# EAGLE design PGA-103-Basic-preamp (EAGLE 7.7.0)
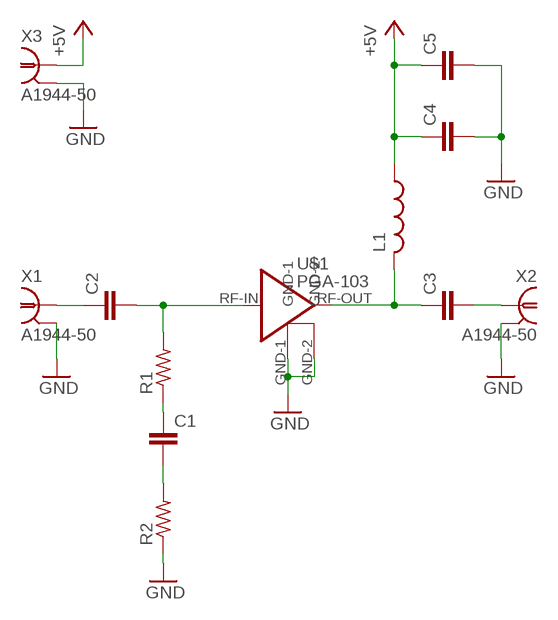
[diagram p0: schematic, sheet 1]

## Parts
C1  C-EUC1206  [C1206]
C2  C-EUC1206  [C1206]
C3  C-EUC1206  [C1206]
C4  C-EUC1206  [C1206]
C5  C-EUC1206  [C1206]
L1  L-US0204/7  [0204/7]
R1  R-US_M1206  [M1206]
R2  R-US_M1206  [M1206]
U$1  PGA-103  [DF782]
X1  A1944-50  [A1944]
X2  A1944-50  [A1944]
X3  A1944-50  [A1944]

## Nets
+5V: C4.1 C5.1 L1.1 X3.1
GND: C4.2 C5.2 R2.1 U$1.GND-1 U$1.GND-2 X1.2 X1.3 X1.4 X1.5 X2.2 X2.3 X2.4 X2.5 X3.2 X3.3 X3.4 X3.5
N$1: C2.1 X1.1
N$2: C3.1 L1.2 U$1.RF-OUT
N$3: C2.2 R1.2 U$1.RF-IN
N$4: C1.1 R1.1
N$5: C1.2 R2.2
N$6: C3.2 X2.1

## Library data of the parts
C1-C5 = rcl:C-EU: CAPACITOR, European symbol
L1 = rcl:L-US: INDUCTOR, American symbol
R1 R2 = rcl:R-US_: RESISTOR, American symbol
U$1 = minicircuits:PGA-103
X1-X3 = con-coax:A1944-50: BNC CONNECTOR 50 Ohm distributor Buerklin 78F2475; OC_FARNELL: unknown; OC_NEWARK: unknown

## Board
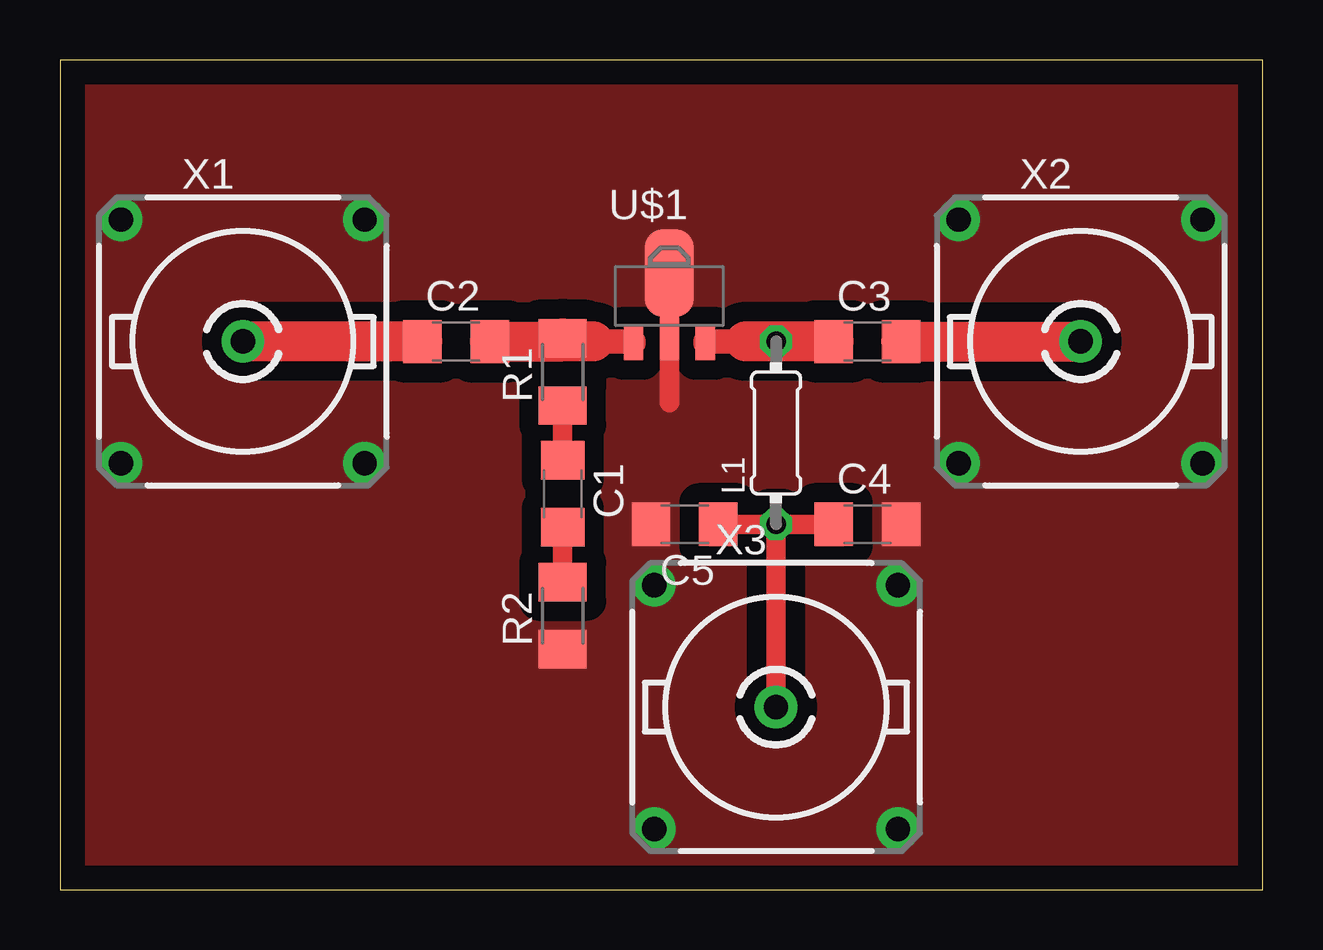
[diagram p1: board, top side]
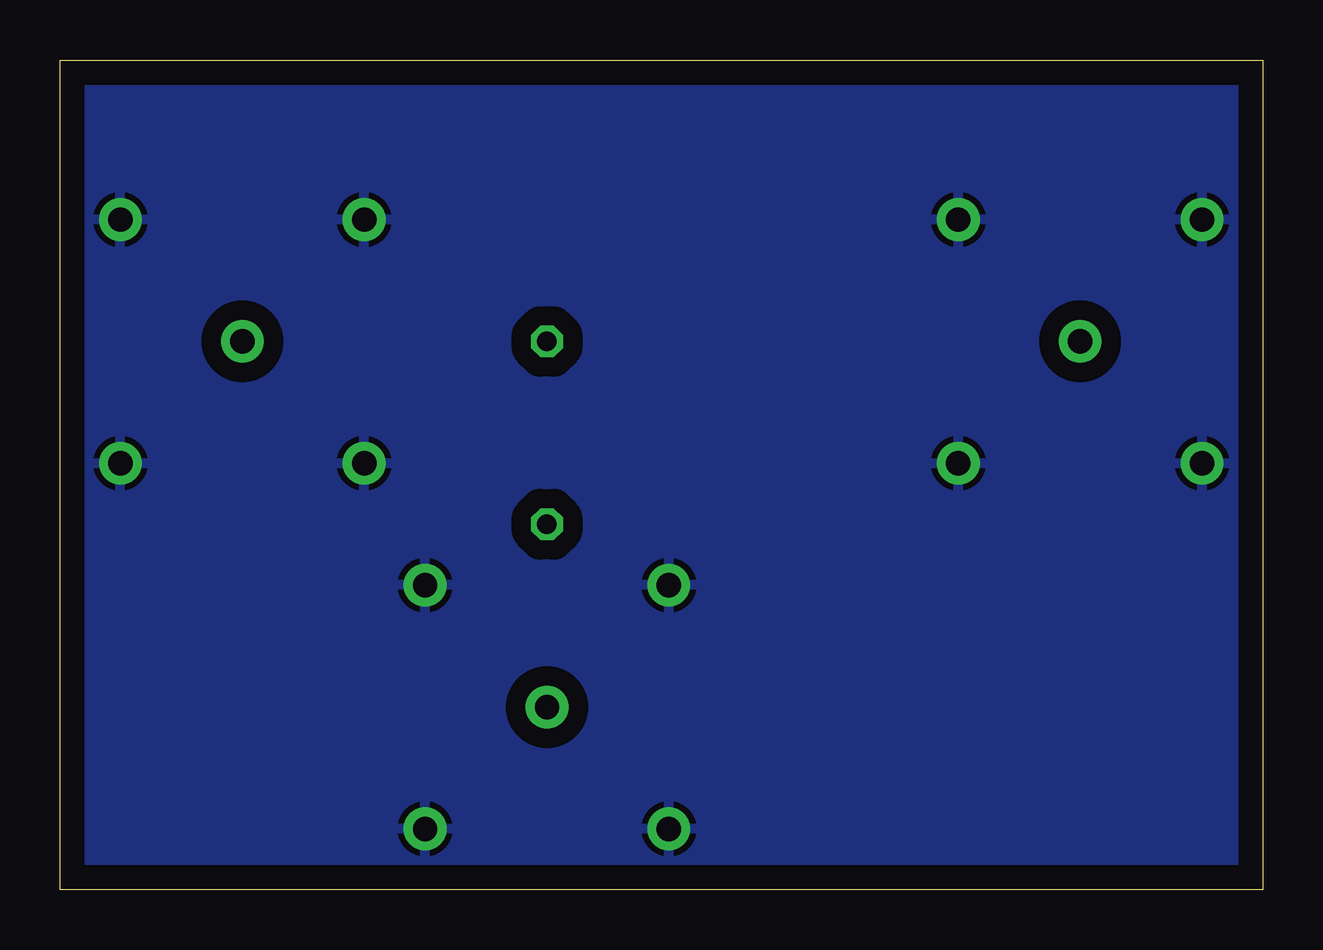
[diagram p2: board, bottom side, seen from below]

Size 50.15 x 34.59 mm. Coordinates in mm from the lower left corner, seen from the top.
Outline: 0,0 50.15,0 50.15,34.59 0,34.59 0,0
Copper layers (1*16): Top 0.035mm / dielectric 1.5mm / Bottom 0.035mm
Design rules "default": minimum track width 10mil, minimum drill 24mil, track to track 8mil, track to pad 8mil, pad to pad 8mil, via to via 8mil, smd to smd 8mil, copper to edge 40mil, drill to drill 8mil, minimum pad ring 10mil, minimum via ring 8mil, stop-mask expansion 4mil, vias tented up to drill 0mil, thermal gap 10mil

### Footprints (pad centres in the part's own frame; a part is rotated, then mirrored left to right if it is on the bottom)
C1206 = smd 1.6 x 1.8: 1 -1.4,0; 2 1.4,0
0204/7 = drill 0.813 octagon: 1 -3.81,0; 2 3.81,0
M1206 = smd 1.6 x 2: 1 -1.4,0; 2 1.4,0
DF782 = smd 0.8 x 1.9: GND-1 0,-1.727 | smd 2.032 x 3.65: GND-2 0,0.94 | smd 0.8 x 1.4: RF-IN -1.499,-1.981; RF-OUT 1.499,-1.981
A1944 = drill 1.016 pad 1.778: 1 0,0; 2 5.08,5.08; 3 -5.08,5.08; 4 -5.08,-5.08; 5 5.08,-5.08

### Placement (x,y rotation side)
C1  20.95,16.51 270 top
C2  16.51,22.86 0 top
C3  33.66,22.86 0 top
C4  33.66,15.24 0 top
C5  26.04,15.24 180 top
L1  29.84,19.05 90 top
R1  20.95,21.59 90 top
R2  20.95,11.43 90 top
U$1  25.4,24.77 0 top
X1  7.62,22.86 0 top
X2  42.55,22.86 0 top
X3  29.84,7.62 0 top

### Tracks (layer width: path | path; a pad name or v marks a point on that pad's centre or on a via)
+5V
  Top 0.813: L1.1 X3.1 | C4.1 L1.1 | C5.1 L1.1
GND
  Top 0.813: 25.4,20.32 U$1.GND-1 25.4,24.77
  pour Top (isolate 0.813, no thermals): 0,34.29 50.16,34.29 50.16,0 0,0
  pour Bottom (isolate 0.813): 0,34.29 50.16,34.29 50.16,0 0,0
N$1
  Top 1.676: C2.1 X1.1
N$2
  Top 1.016: 28.57,22.86 26.9,22.86 U$1.RF-OUT
  Top 1.676: 28.57,22.86 L1.2 C3.1
N$3
  Top 1.016: 22.23,22.86 23.9,22.86 U$1.RF-IN
  Top 1.676: 22.23,22.86 20.95,22.86 | C2.2 20.95,22.86 | 20.95,22.86 R1.2
N$4
  Top 0.813: R1.1 C1.1
N$5
  Top 0.813: C1.2 R2.2
N$6
  Top 1.676: C3.2 X2.1